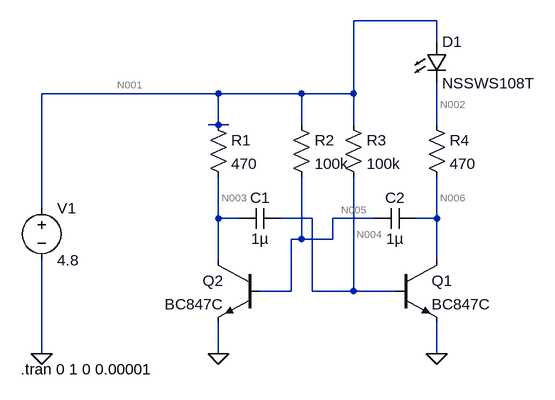
[diagram p0: schematic astable_led_blinker.asc]
astable_led_blinker.asc, the LTspice schematic file:
Version 4
SHEET 1 880 680
WIRE 320 -224 192 -224
WIRE 320 -192 320 -224
WIRE -16 -112 -288 -112
WIRE 112 -112 -16 -112
WIRE 192 -112 192 -224
WIRE 192 -112 112 -112
WIRE -16 -64 -16 -112
WIRE -16 -64 -32 -64
WIRE 0 -64 -16 -64
WIRE 112 -64 112 -112
WIRE 192 -64 192 -112
WIRE 320 -64 320 -128
WIRE -288 64 -288 -112
WIRE -16 80 -16 16
WIRE 16 80 -16 80
WIRE 128 80 80 80
WIRE 224 80 160 80
WIRE 320 80 320 16
WIRE 320 80 288 80
WIRE 112 112 112 16
WIRE 112 112 96 112
WIRE 160 112 160 80
WIRE 160 112 112 112
WIRE -16 144 -16 80
WIRE 320 144 320 80
WIRE 96 192 96 112
WIRE 96 192 48 192
WIRE 128 192 128 80
WIRE 192 192 192 16
WIRE 192 192 128 192
WIRE 256 192 192 192
WIRE -288 288 -288 144
WIRE -16 288 -16 240
WIRE 320 288 320 240
FLAG -16 288 0
FLAG 320 288 0
FLAG -288 288 0
SYMBOL npn 256 144 R0
SYMATTR InstName Q1
SYMATTR Value BC847C
SYMBOL npn 48 144 M0
SYMATTR InstName Q2
SYMATTR Value BC847C
SYMBOL voltage -288 48 R0
WINDOW 123 0 0 Left 2
WINDOW 39 0 0 Left 2
SYMATTR InstName V1
SYMATTR Value 4.8
SYMBOL cap 80 64 R90
WINDOW 0 0 32 VBottom 2
WINDOW 3 32 32 VTop 2
SYMATTR InstName C1
SYMATTR Value 1µ
SYMBOL cap 288 64 R90
WINDOW 0 0 32 VBottom 2
WINDOW 3 32 32 VTop 2
SYMATTR InstName C2
SYMATTR Value 1µ
SYMBOL res -32 -80 R0
SYMATTR InstName R1
SYMATTR Value 470
SYMBOL res 96 -80 R0
SYMATTR InstName R2
SYMATTR Value 100k
SYMBOL res 176 -80 R0
SYMATTR InstName R3
SYMATTR Value 100k
SYMBOL res 304 -80 R0
SYMATTR InstName R4
SYMATTR Value 470
SYMBOL LED 304 -192 R0
SYMATTR InstName D1
SYMATTR Value NSSWS108T
TEXT -320 312 Left 2 !.tran 0 1 0 0.00001

The netlist it stands for:
* astable_led_blinker.asc
Q1 N006 N004 0 0 BC847C
Q2 N003 N005 0 0 BC847C
V1 N001 0 4.8
C1 N004 N003 1µ
C2 N006 N005 1µ
R1 N001 N003 470
R2 N001 N005 100k
R3 N001 N004 100k
R4 N002 N006 470
D1 N001 N002 NSSWS108T
.model D D
.lib standard.dio
.model NPN NPN
.model PNP PNP
.lib standard.bjt
.tran 0 1 0 0.00001
.backanno
.end

* Results of the author's LTspice run, read from the files saved beside the schematic
* Operating Point, zero values left out:
*   V(n006) = 76.99 mV
*   V(n004) = 670.9 mV
*   V(n003) = 125.1 mV
*   V(n005) = 698.5 mV
*   V(n001) = 4.8 V
*   V(n002) = 1.945 V
*   Ic(Q2) = 9.946 mA
*   Ib(Q2) = 41.01 µA
*   Ie(Q2) = -9.988 mA
*   Ic(Q1) = 3.974 mA
*   Ib(Q1) = 41.29 µA
*   Ie(Q1) = -4.015 mA
*   I(D1) = 3.974 mA
*   I(R4) = 3.974 mA
*   I(R3) = 41.29 µA
*   I(R2) = 41.02 µA
*   I(R1) = 9.946 mA
*   I(V1) = -14 mA
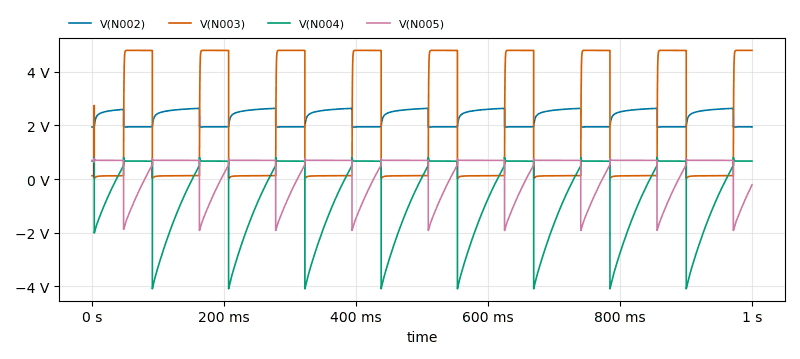
[diagram p1: Transient Analysis of astable_led_blinker.asc, plotted from the saved traces]
* Transient Analysis, 1 run:
*   V(N002): min 1.94 V, max 2.638 V, average 2.314 V, rms 2.333 V, last 1.945 V
*   V(N003): min 29.41 mV, max 4.8 V, average 1.885 V, rms 2.942 V, last 4.8 V
*   V(N004): min -4.093 V, max 806 mV, average -622.2 mV, rms 1.568 V, last 671.2 mV
*   V(N005): min -1.918 V, max 762.8 mV, average 198.7 mV, rms 792.5 mV, last -217.2 mV